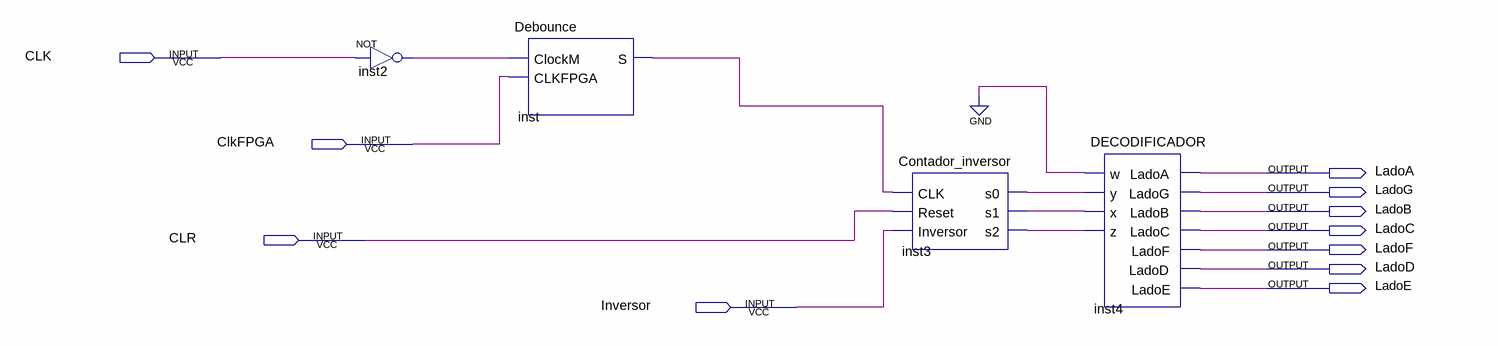
[diagram p0: schematic sheet]
// Quartus schematic Projeto1.bdf as structural Verilog: 4 symbols, 11 pins
module Projeto1 (
  input  CLK,
  input  ClkFPGA,
  input  CLR,
  input  Inversor,
  output LadoA,
  output LadoG,
  output LadoB,
  output LadoC,
  output LadoF,
  output LadoD,
  output LadoE
);

  wire inst2_out, inst3_s0, inst3_s1, inst3_s2, inst_s;

  not inst2 (inst2_out, CLK);
  Debounce inst (.ClockM(inst2_out), .CLKFPGA(ClkFPGA), .S(inst_s));
  Contador_inversor inst3 (.CLK(inst_s), .Reset(CLR), .Inversor(Inversor), .s0(inst3_s0), .s1(inst3_s1), .s2(inst3_s2));
  DECODIFICADOR inst4 (
    .w(1'b0), .y(inst3_s0), .x(inst3_s1), .z(inst3_s2), .LadoA(LadoA), .LadoG(LadoG), .LadoB(LadoB),
    .LadoC(LadoC), .LadoF(LadoF), .LadoD(LadoD), .LadoE(LadoE));
endmodule
